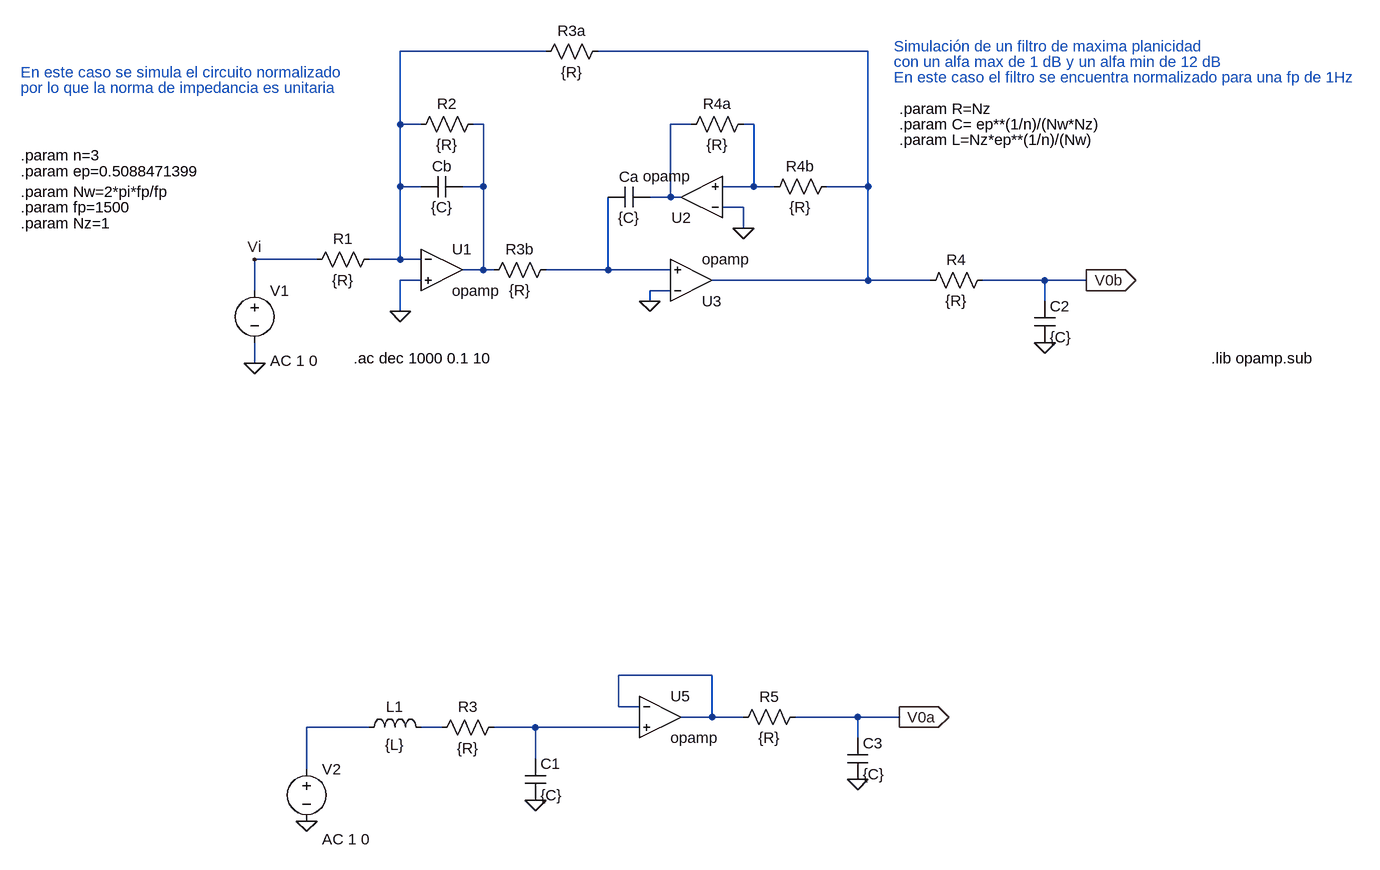
[diagram p0: schematic sim.asc]
sim.asc, the LTspice schematic file:
Version 4
SHEET 1 1452 764
WIRE 16 -464 -208 -464
WIRE 512 -464 96 -464
WIRE -208 -352 -208 -464
WIRE -176 -352 -208 -352
WIRE -80 -352 -96 -352
WIRE 240 -352 208 -352
WIRE 336 -352 320 -352
WIRE -208 -256 -208 -352
WIRE -176 -256 -208 -256
WIRE -80 -256 -80 -352
WIRE -80 -256 -112 -256
WIRE 336 -256 336 -352
WIRE 336 -256 288 -256
WIRE 368 -256 336 -256
WIRE 512 -256 512 -464
WIRE 512 -256 448 -256
WIRE 208 -240 208 -352
WIRE 208 -240 176 -240
WIRE 224 -240 208 -240
WIRE 320 -224 288 -224
WIRE 320 -192 320 -224
WIRE -336 -144 -432 -144
WIRE -208 -144 -208 -256
WIRE -208 -144 -256 -144
WIRE -176 -144 -208 -144
WIRE -80 -128 -80 -256
WIRE -80 -128 -112 -128
WIRE -64 -128 -80 -128
WIRE 112 -128 112 -240
WIRE 112 -128 16 -128
WIRE 208 -128 112 -128
WIRE -176 -112 -208 -112
WIRE 512 -112 512 -256
WIRE 512 -112 272 -112
WIRE 608 -112 512 -112
WIRE 784 -112 688 -112
WIRE 848 -112 784 -112
WIRE -432 -96 -432 -144
WIRE 208 -96 176 -96
WIRE 176 -80 176 -96
WIRE 784 -80 784 -112
WIRE -208 -64 -208 -112
WIRE -432 16 -432 -16
WIRE 272 496 128 496
WIRE 128 544 128 496
WIRE 160 544 128 544
WIRE 272 560 272 496
WIRE 272 560 224 560
WIRE 320 560 272 560
WIRE 496 560 400 560
WIRE 560 560 496 560
WIRE -256 576 -352 576
WIRE -144 576 -176 576
WIRE 0 576 -64 576
WIRE 160 576 0 576
WIRE 496 592 496 560
WIRE 0 624 0 576
WIRE -352 640 -352 576
FLAG 848 -112 V0b
IOPIN 848 -112 Out
FLAG -432 16 0
FLAG -208 -64 0
FLAG 176 -80 0
FLAG 320 -192 0
FLAG -432 -144 Vi
FLAG 0 688 0
FLAG 784 -16 0
FLAG -352 720 0
FLAG 560 560 V0a
IOPIN 560 560 Out
FLAG 496 656 0
SYMBOL res 464 -272 R90
WINDOW 0 0 56 VBottom 2
WINDOW 3 32 56 VTop 2
SYMATTR InstName R4b
SYMATTR Value {R}
SYMBOL res 336 -368 R90
WINDOW 0 0 56 VBottom 2
WINDOW 3 32 56 VTop 2
SYMATTR InstName R4a
SYMATTR Value {R}
SYMBOL res -240 -160 R90
WINDOW 0 0 56 VBottom 2
WINDOW 3 32 56 VTop 2
SYMATTR InstName R1
SYMATTR Value {R}
SYMBOL res 32 -144 R90
WINDOW 0 0 56 VBottom 2
WINDOW 3 32 56 VTop 2
SYMATTR InstName R3b
SYMATTR Value {R}
SYMBOL cap 112 -256 M90
WINDOW 0 0 32 VBottom 2
WINDOW 3 32 32 VTop 2
SYMATTR InstName Ca
SYMATTR Value {C}
SYMBOL cap -112 -272 R90
WINDOW 0 0 32 VBottom 2
WINDOW 3 32 32 VTop 2
SYMATTR InstName Cb
SYMATTR Value {C}
SYMBOL res -80 -368 R90
WINDOW 0 0 56 VBottom 2
WINDOW 3 32 56 VTop 2
SYMATTR InstName R2
SYMATTR Value {R}
SYMBOL res 112 -480 R90
WINDOW 0 0 56 VBottom 2
WINDOW 3 32 56 VTop 2
SYMATTR InstName R3a
SYMATTR Value {R}
SYMBOL voltage -432 -112 R0
WINDOW 123 24 124 Left 2
WINDOW 39 0 0 Left 2
SYMATTR Value2 AC 1 0
SYMATTR InstName V1
SYMATTR Value ""
SYMBOL OpAmps\\opamp -144 -192 R0
SYMATTR InstName U1
SYMBOL OpAmps\\opamp 256 -176 R180
SYMATTR InstName U2
SYMBOL OpAmps\\opamp 240 -48 M180
SYMATTR InstName U3
SYMBOL res -48 560 R90
WINDOW 0 0 56 VBottom 2
WINDOW 3 32 56 VTop 2
SYMATTR InstName R3
SYMATTR Value {R}
SYMBOL res 704 -128 R90
WINDOW 0 0 56 VBottom 2
WINDOW 3 32 56 VTop 2
SYMATTR InstName R4
SYMATTR Value {R}
SYMBOL cap -16 624 R0
SYMATTR InstName C1
SYMATTR Value {C}
SYMBOL cap 768 -80 R0
SYMATTR InstName C2
SYMATTR Value {C}
SYMBOL ind -272 592 R270
WINDOW 0 32 56 VTop 2
WINDOW 3 5 56 VBottom 2
SYMATTR InstName L1
SYMATTR Value {L}
SYMBOL voltage -352 624 R0
WINDOW 123 24 124 Left 2
WINDOW 39 0 0 Left 2
SYMATTR Value2 AC 1 0
SYMATTR InstName V2
SYMATTR Value ""
SYMBOL res 416 544 R90
WINDOW 0 0 56 VBottom 2
WINDOW 3 32 56 VTop 2
SYMATTR InstName R5
SYMATTR Value {R}
SYMBOL cap 480 592 R0
SYMATTR InstName C3
SYMATTR Value {C}
SYMBOL OpAmps\\opamp 192 496 R0
SYMATTR InstName U5
TEXT -280 8 Left 2 !.ac dec 1000 0.1 10
TEXT 1040 8 Left 2 !.lib opamp.sub
TEXT 560 -376 Left 2 !.param R=Nz
TEXT 560 -352 Left 2 !.param C= ep**(1/n)/(Nw*Nz)
TEXT 560 -328 Left 2 !.param L=Nz*ep**(1/n)/(Nw)
TEXT -792 -304 Left 2 !.param n=3
TEXT -792 -280 Left 2 !.param ep=0.5088471399
TEXT 552 -472 Left 2 ;Simulación de un filtro de maxima planicidad
TEXT 552 -448 Left 2 ;con un alfa max de 1 dB y un alfa min de 12 dB
TEXT 552 -424 Left 2 ;En este caso el filtro se encuentra normalizado para una fp de 1Hz
TEXT -792 -248 Left 2 !.param Nw=2*pi*fp/fp
TEXT -792 -224 Left 2 !.param fp=1500
TEXT -792 -432 Left 2 ;En este caso se simula el circuito normalizado
TEXT -792 -408 Left 2 ;por lo que la norma de impedancia es unitaria
TEXT -792 -200 Left 2 !.param Nz=1

The netlist it stands for:
* sim.asc
R4b N002 N005 {R}
R4a N005 N004 {R}
R1 N001 Vi {R}
R3b N006 N003 {R}
Ca N006 N004 {C}
Cb N003 N001 {C}
R2 N003 N001 {R}
R3a N002 N001 {R}
V1 Vi 0 AC 1 0
XU1 N001 0 N003 opamp Aol=100K GBW=10Meg  ; pins invin noninvin out
XU2 0 N005 N004 opamp Aol=100K GBW=10Meg  ; pins invin noninvin out
XU3 0 N006 N002 opamp Aol=100K GBW=10Meg  ; pins invin noninvin out
R3 N010 N009 {R}
R4 V0b N002 {R}
C1 N010 0 {C}
C2 V0b 0 {C}
L1 N008 N009 {L}
V2 N008 0 AC 1 0
R5 V0a N007 {R}
C3 V0a 0 {C}
XU5 N007 N010 N007 opamp Aol=100K GBW=10Meg  ; pins invin noninvin out
.ac dec 1000 0.1 10
.lib opamp.sub
.param R=Nz
.param C= ep**(1/n)/(Nw*Nz)
.param L=Nz*ep**(1/n)/(Nw)
.param n=3
.param ep=0.5088471399
* Simulación de un filtro de maxima planicidad
* con un alfa max de 1 dB y un alfa min de 12 dB
* En este caso el filtro se encuentra normalizado para una fp de 1Hz
.param Nw=2*pi*fp/fp
.param fp=1500
* En este caso se simula el circuito normalizado
* por lo que la norma de impedancia es unitaria
.param Nz=1
.backanno
.end